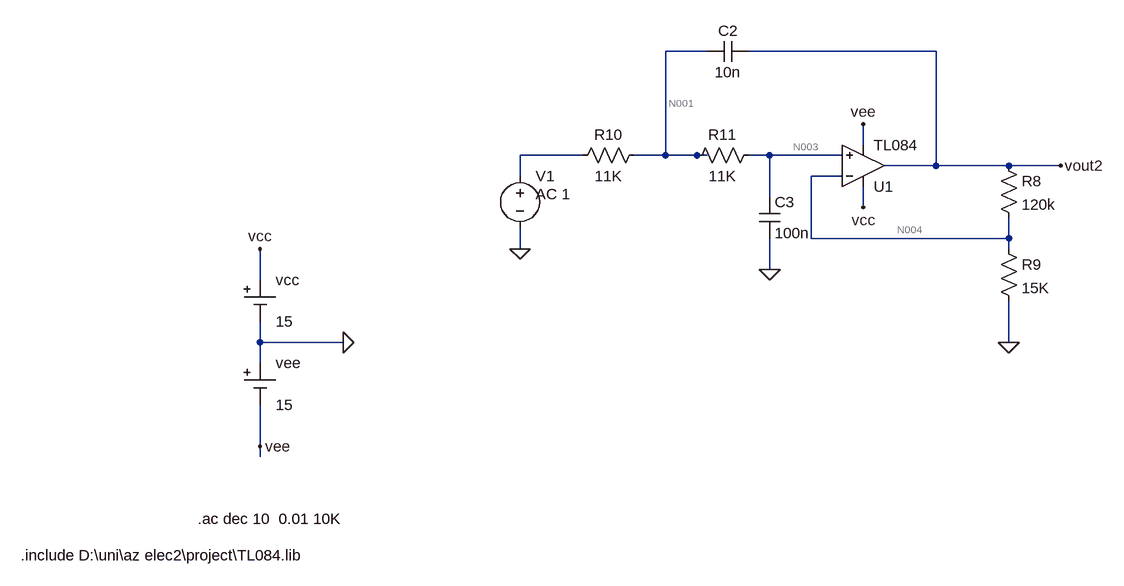
[diagram p0: schematic LPF.asc]
LPF.asc, the LTspice schematic file:
Version 4
SHEET 1 1844 680
WIRE 1216 -656 1152 -656
WIRE 1568 -656 1280 -656
WIRE 1456 -512 1456 -544
WIRE 1024 -496 928 -496
WIRE 1152 -496 1152 -656
WIRE 1152 -496 1104 -496
WIRE 1200 -496 1152 -496
WIRE 1216 -496 1200 -496
WIRE 1312 -496 1280 -496
WIRE 1424 -496 1312 -496
WIRE 1568 -480 1568 -656
WIRE 1568 -480 1488 -480
WIRE 1680 -480 1568 -480
WIRE 1760 -480 1680 -480
WIRE 928 -464 928 -496
WIRE 1424 -464 1376 -464
WIRE 1312 -432 1312 -496
WIRE 1456 -416 1456 -448
WIRE 1376 -368 1376 -464
WIRE 1680 -368 1680 -400
WIRE 1680 -368 1376 -368
WIRE 928 -352 928 -384
WIRE 1680 -352 1680 -368
WIRE 1312 -320 1312 -368
WIRE 528 -304 528 -352
WIRE 528 -208 528 -240
WIRE 656 -208 528 -208
WIRE 1680 -208 1680 -272
WIRE 528 -176 528 -208
WIRE 528 -48 528 -112
WIRE 528 -32 528 -48
FLAG 1312 -320 0
FLAG 1680 -208 0
FLAG 928 -352 0
FLAG 1760 -480 vout2
FLAG 1456 -544 vee
FLAG 1456 -416 vcc
FLAG 656 -208 0
FLAG 528 -352 vcc
FLAG 528 -48 vee
SYMBOL OpAmps\\opamp2 1456 -416 M180
SYMATTR InstName U1
SYMATTR Value TL084
SYMBOL res 1664 -496 R0
SYMATTR InstName R8
SYMATTR Value 120k
SYMBOL res 1664 -368 R0
SYMATTR InstName R9
SYMATTR Value 15K
SYMBOL res 1296 -512 R90
WINDOW 0 0 56 VBottom 2
WINDOW 3 32 56 VTop 2
SYMATTR InstName R11
SYMATTR Value 11K
SYMBOL res 1120 -512 R90
WINDOW 0 0 56 VBottom 2
WINDOW 3 32 56 VTop 2
SYMATTR InstName R10
SYMATTR Value 11K
SYMBOL cap 1296 -432 R0
SYMATTR InstName C3
SYMATTR Value 100n
SYMBOL cap 1280 -672 R90
WINDOW 0 0 32 VBottom 2
WINDOW 3 32 32 VTop 2
SYMATTR InstName C2
SYMATTR Value 10n
SYMBOL voltage 928 -480 R0
WINDOW 123 24 44 Left 2
WINDOW 39 0 0 Left 0
SYMATTR InstName V1
SYMATTR Value ""
SYMATTR Value2 AC 1
SYMBOL Misc\\cell 528 -304 R0
SYMATTR InstName vcc
SYMATTR Value 15
SYMBOL Misc\\cell 528 -176 R0
SYMATTR InstName vee
SYMATTR Value 15
TEXT 160 120 Left 2 !.include D:\\uni\\az elec2\\project\\TL084.lib
TEXT 432 64 Left 2 !.ac dec 10  0.01 10K

The netlist it stands for:
* LPF.asc
XU1 N003 N004 vcc vee vout2 TL084  ; pins In+ In- V+ V- OUT
R8 vout2 N004 120k
R9 N004 0 15K
R11 N003 N001 11K
R10 N001 N002 11K
C3 N003 0 100n
C2 vout2 N001 10n
V1 N002 0 AC 1
vcc vcc 0 15
vee 0 vee 15
.include D:\uni\az elec2\project\TL084.lib
.ac dec 10  0.01 10K
.backanno
.end

* Results of the author's LTspice run, read from the files saved beside the schematic
* Operating Point, zero values left out:
*   V(vout2) = 95.22 µV
*   V(vee) = -15 V
*   V(vcc) = 15 V
*   V(n004) = 9.979 µV
*   V(n003) = -991.2 nV
*   V(n001) = -495.6 nV
*   I(R10) = -45.05 pA
*   I(R11) = -45.05 pA
*   I(R9) = 665.3 pA
*   I(R8) = 710.3 pA
*   I(Vee) = -14.19 mA
*   I(Vcc) = -14.19 mA
*   I(V1) = -45.05 pA
*   Ix(u1:1) = 45.05 pA
*   Ix(u1:2) = 45.05 pA
*   Ix(u1:3) = 14.19 mA
*   Ix(u1:4) = -14.19 mA
*   Ix(u1:5) = -710.3 pA
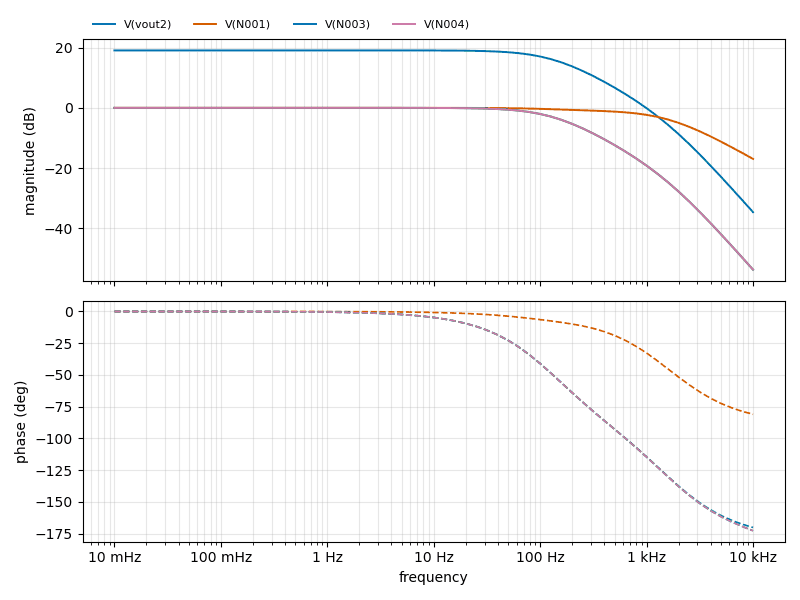
[diagram p1: AC Analysis of LPF.asc, plotted from the saved traces]
* AC Analysis, 1 run:
*   V(vout2): 19.08 dB at 10 mHz, -34.64 dB at 10 kHz, peak 19.08 dB at 10 mHz, 3 dB below the peak at 129.2 Hz
*   V(N001): -0.00 dB at 10 mHz, -16.95 dB at 10 kHz, peak -0.00 dB at 10 mHz, 3 dB below the peak at 1.267 kHz
*   V(N003): -0.00 dB at 10 mHz, -53.74 dB at 10 kHz, peak -0.00 dB at 10 mHz, 3 dB below the peak at 129.2 Hz
*   V(N004): -0.00 dB at 10 mHz, -53.73 dB at 10 kHz, peak -0.00 dB at 10 mHz, 3 dB below the peak at 129.2 Hz